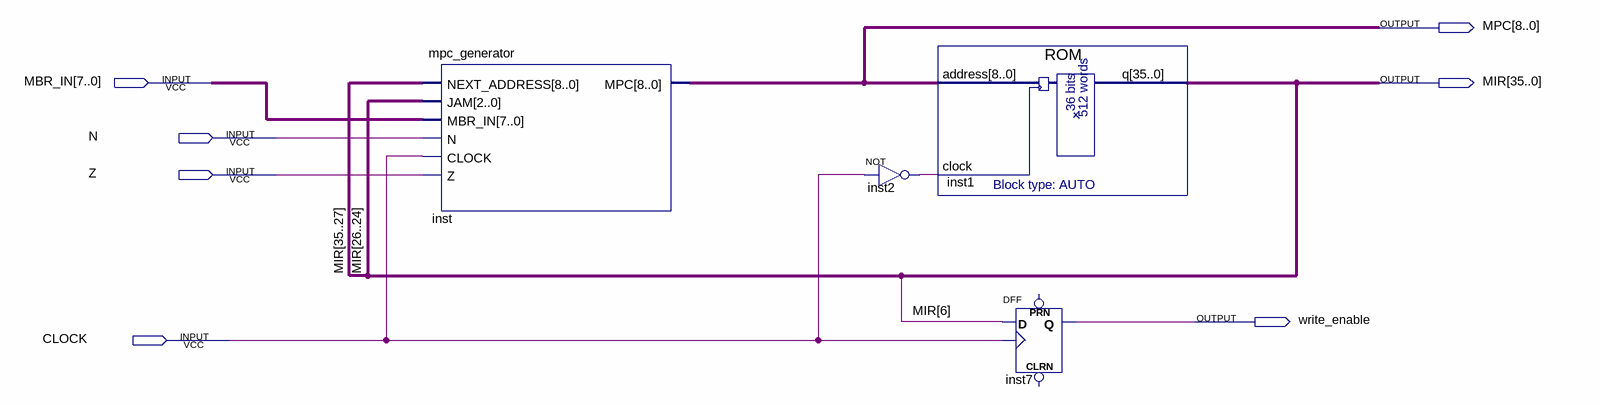
[diagram p0: schematic sheet]
// Quartus schematic CONTROL_UNIT.bdf as structural Verilog: 4 symbols, 7 pins
module CONTROL_UNIT (
  input  [7:0] MBR_IN,
  input  N,
  input  Z,
  input  CLOCK,
  output [8:0] MPC,
  output [35:0] MIR,
  output write_enable
);

  wire inst2_out;

  mpc_generator inst (
    .NEXT_ADDRESS(MIR[35:27]), .JAM(MIR[26:24]), .MBR_IN(MBR_IN), .N(N), .CLOCK(CLOCK), .Z(Z), .MPC(MPC));
  not inst2 (inst2_out, CLOCK);
  ROM inst1 (.address(MPC), .clock(inst2_out), .q(MIR));
  DFF inst7 (.CLK(CLOCK), .D(MIR[6]), .Q(write_enable));  // open: CLRN, PRN
endmodule
